# EAGLE design mr_radar_sandcastle (EAGLE 5.11)
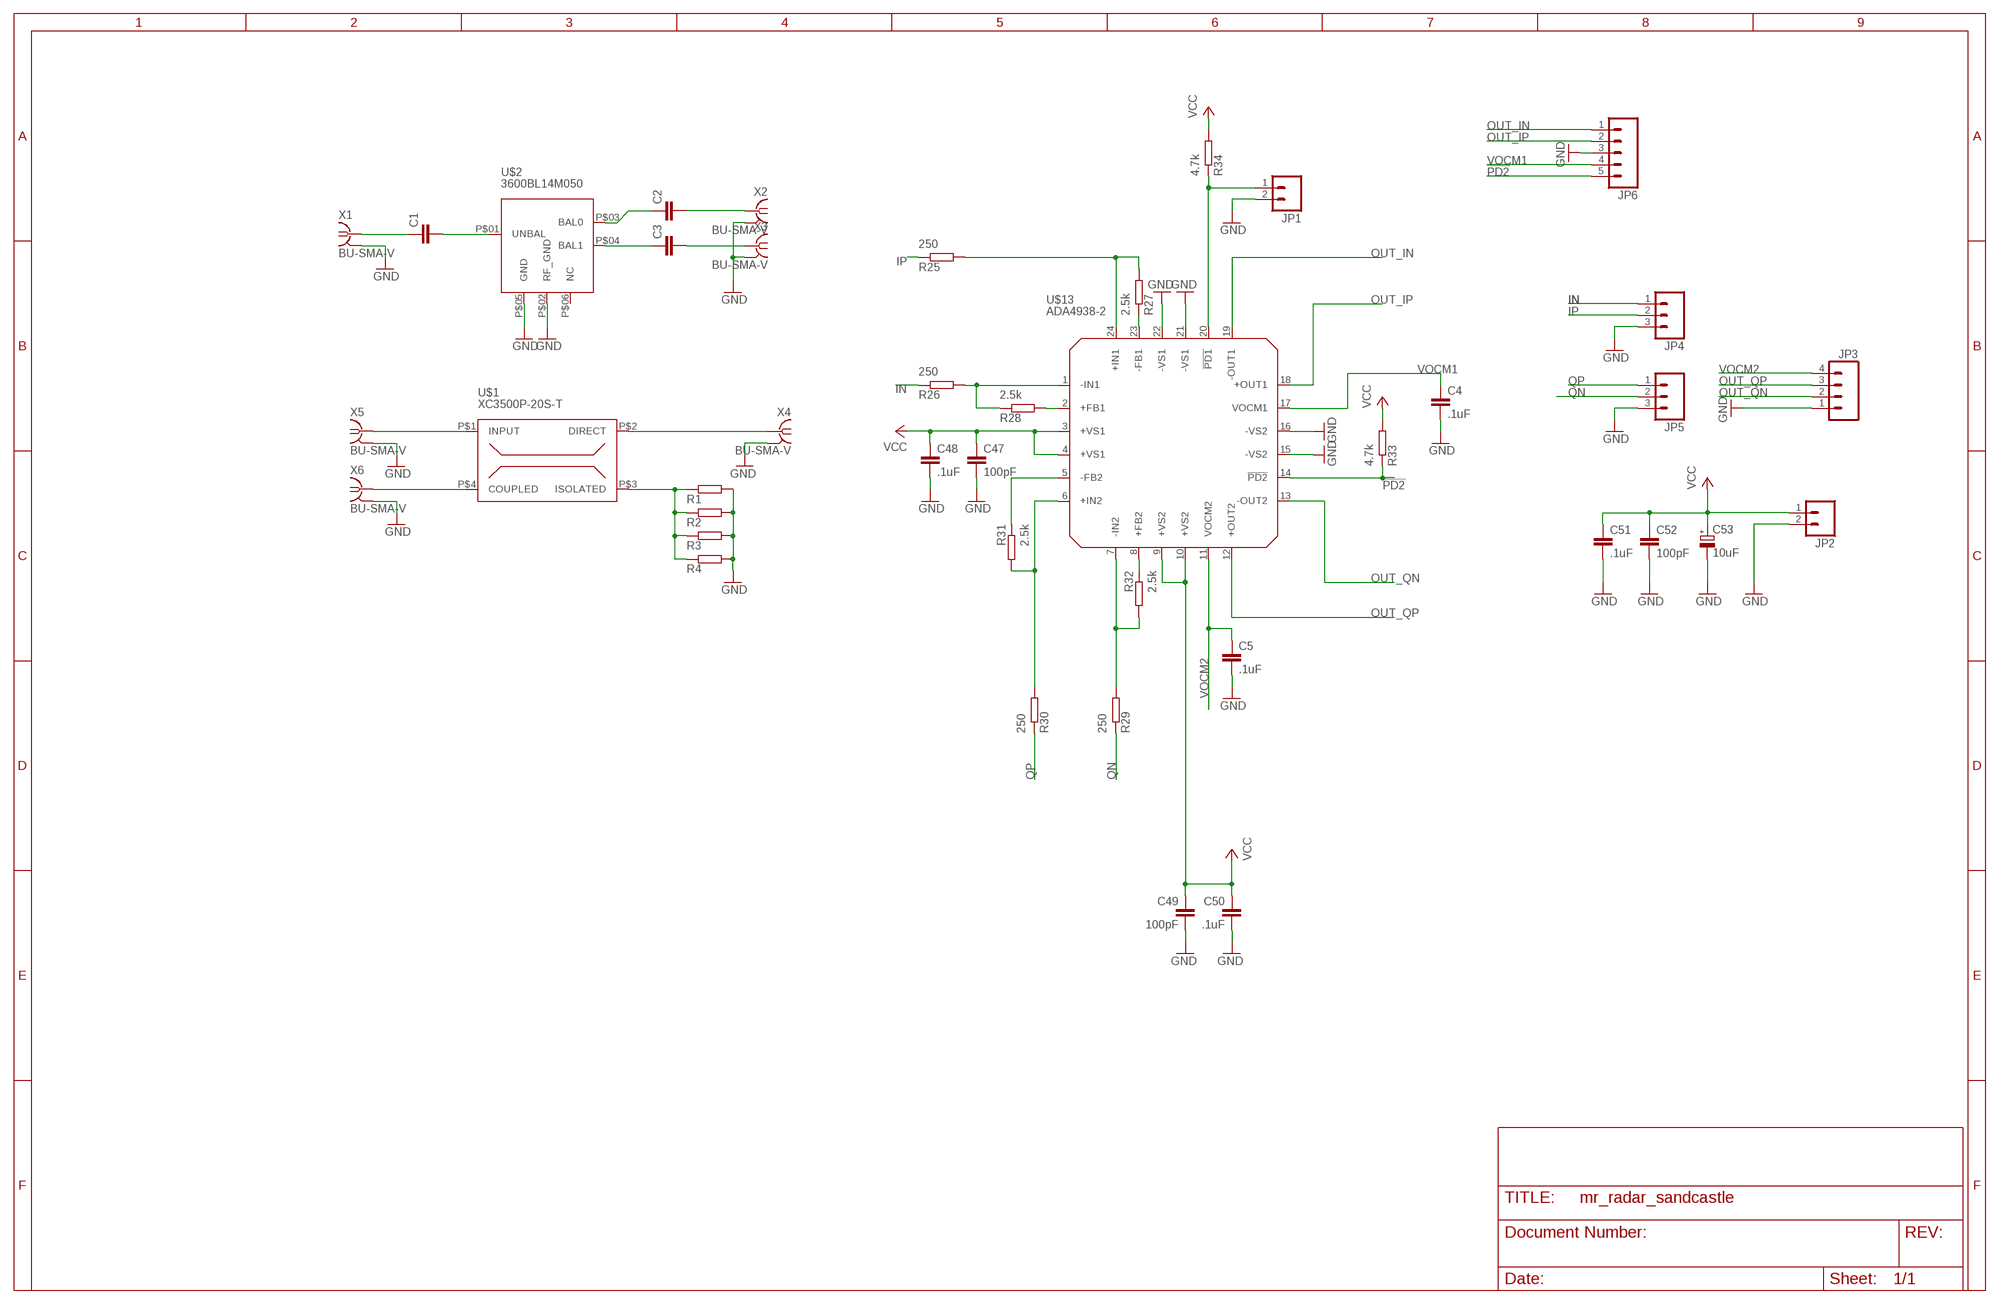
[diagram p0: schematic, sheet 1]

## Parts
C1  CAPACITOR-0603  [0603-CAP]
C2  CAPACITOR-0603  [0603-CAP]
C3  CAPACITOR-0603  [0603-CAP]
C4  .1uF  CAPACITOR-0603  [0603-CAP]
C5  .1uF  CAPACITOR-0603  [0603-CAP]
C47  100pF  CAPACITOR-0603  [0603-CAP]
C48  .1uF  CAPACITOR-0603  [0603-CAP]
C49  100pF  CAPACITOR-0603  [0603-CAP]
C50  .1uF  CAPACITOR-0603  [0603-CAP]
C51  .1uF  CAPACITOR-0603  [0603-CAP]
C52  100pF  CAPACITOR-0603  [0603-CAP]
C53  10uF  CAPACITOR-POL-0805  [0805-POL-CAP]
JP1  M02PTH  [1X02]
JP2  M02PTH  [1X02]
JP3  M04PTH  [1X04]
JP4  M03PTH  [1X03]
JP5  M03PTH  [1X03]
JP6  M05PTH  [1X05]
R1  RESISTOR-0402  [0402-RES]
R2  RESISTOR-0402  [0402-RES]
R3  RESISTOR-0402  [0402-RES]
R4  RESISTOR-0402  [0402-RES]
R25  250  RESISTOR-0603  [0603-RES]
R26  250  RESISTOR-0603  [0603-RES]
R27  2.5k  RESISTOR-0603  [0603-RES]
R28  2.5k  RESISTOR-0603  [0603-RES]
R29  250  RESISTOR-0603  [0603-RES]
R30  250  RESISTOR-0603  [0603-RES]
R31  2.5k  RESISTOR-0603  [0603-RES]
R32  2.5k  RESISTOR-0603  [0603-RES]
R33  4.7k  RESISTOR-0603  [0603-RES]
R34  4.7k  RESISTOR-0603  [0603-RES]
U$1  XC3500P-20S-T  [XC3500P-20S-T]
U$2  3600BL14M050  [3600BL14M050]
U$13  ADA4938-2  [LFCSP24]
X1  BU-SMA-V  [BU-SMA-V]
X2  BU-SMA-V  [BU-SMA-V]
X3  BU-SMA-V  [BU-SMA-V]
X4  BU-SMA-V  [BU-SMA-V]
X5  BU-SMA-V  [BU-SMA-V]
X6  BU-SMA-V  [BU-SMA-V]

## Nets
!PD2: JP6.5 R33.P$1 U$13.14(!PD2)
GND: C4.P$2 C5.P$2 C47.P$2 C48.P$2 C49.P$2 C50.P$2 C51.P$2 C52.P$2 C53.- JP1.2 JP2.2 JP3.1 JP4.3 JP5.3 JP6.3 R1.P$2 R2.P$2 R3.P$2 R4.P$2 U$2.P$02(RF_GND) U$2.P$05(GND) U$13.15(-VS2) U$13.16(-VS2) U$13.21(-VS1) U$13.22(-VS1) X1.2(GND) X2.2(GND) X3.2(GND) X4.2(GND) X5.2(GND) X6.2(GND)
IN: JP4.1 R26.P$1
IP: JP4.2 R25.P$1
N$1: C1.P$1 X1.1
N$2: C3.P$1 U$2.P$04(BAL1)
N$3: C2.P$1 U$2.P$03(BAL0)
N$4: C1.P$2 U$2.P$01(UNBAL)
N$5: C3.P$2 X3.1
N$6: C2.P$2 X2.1
N$7: R1.P$1 R2.P$1 R3.P$1 R4.P$1 U$1.P$3(ISOLATED)
N$12: U$1.P$1(INPUT) X5.1
N$13: U$1.P$4(COUPLED) X6.1
N$14: U$1.P$2(DIRECT) X4.1
N$59: R26.P$2 R28.P$1 U$13.1(-IN1)
N$60: R28.P$2 U$13.2(+FB1)
N$61: R30.P$2 R31.P$2 U$13.6(+IN2)
N$63: R29.P$2 R32.P$2 U$13.7(-IN2)
N$64: R27.P$1 U$13.23(-FB1)
N$65: R32.P$1 U$13.8(+FB2)
N$67: R25.P$2 R27.P$2 U$13.24(+IN1)
N$68: R31.P$1 U$13.5(-FB2)
N$70: JP1.1 R34.P$1 U$13.20(!PD1)
OUT_IN: JP6.1 U$13.19(-OUT1)
OUT_IP: JP6.2 U$13.18(+OUT1)
OUT_QN: JP3.2 U$13.13(-OUT2)
OUT_QP: JP3.3 U$13.12(+OUT2)
QN: JP5.2 R29.P$1
QP: JP5.1 R30.P$1
VCC: C47.P$1 C48.P$1 C49.P$1 C50.P$1 C51.P$1 C52.P$1 C53.+ JP2.1 R33.P$2 R34.P$2 U$13.3(+VS1) U$13.4(+VS1) U$13.9(+VS2) U$13.10(+VS2)
VOCM1: C4.P$1 JP6.4 U$13.17(VOCM1)
VOCM2: C5.P$1 JP3.4 U$13.11(VOCM2)
Unconnected: U$2.P$06(NC)

## Power pins joined to a net without a drawn wire
GND: U$13.EXP(GND) X1.3(GND) X1.4(GND) X1.5(GND) X2.3(GND) X2.4(GND) X2.5(GND) X3.3(GND) X3.4(GND) X3.5(GND) X4.3(GND) X4.4(GND) X4.5(GND) X5.3(GND) X5.4(GND) X5.5(GND) X6.3(GND) X6.4(GND) X6.5(GND)

## Library data of the parts
C1-C5 C47-C52 = pel_dipol_comp:CAPACITOR
C53 = pel_dipol_comp:CAPACITOR-POL
JP1 JP2 = SparkFun:M02: Header 2 Standard 2-pin 0.1" header. Use with straight break away headers (SKU : PRT-00116), right angle break away headers (PRT-00553), swiss pins (PRT-00743), machine pins (PRT-00117), and female headers (PRT-00115). Molex polarized connector foot print use with SKU : PRT-08233 with associated crimp pins and housings.
JP3 = SparkFun2:M04: Header 4 Standard 4-pin 0.1" header. Use with straight break away headers (SKU : PRT-00116), right angle break away headers (PRT-00553), swiss pins (PRT-00743), machine pins (PRT-00117), and female headers (PRT-00115). Molex polarized connector foot print use with SKU : PRT-08231 with associated crimp pins and housings.
JP4 JP5 = SparkFun:M03: Header 3 Standard 3-pin 0.1" header. Use with straight break away headers (SKU : PRT-00116), right angle break away headers (PRT-00553), swiss pins (PRT-00743), machine pins (PRT-00117), and female headers (PRT-00115). Molex polarized connector foot print use with SKU : PRT-08232 with associated crimp pins and housings.
JP6 = SparkFun2:M05: Header 5 Standard 5-pin 0.1" header. Use with straight break away headers (SKU : PRT-00116), right angle break away headers (PRT-00553), swiss pins (PRT-00743), machine pins (PRT-00117), and female headers (PRT-00115). Molex polarized connector foot print use with SKU : PRT-08230 with associated crimp pins and housings.
R1-R4 R25-R34 = pel_dipol_comp:RESISTOR
U$1 = mr_radar:XC3500P-20S-T
U$2 = mr_radar:3600BL14M050
U$13 = mr_radar:ADA4938-2
X1-X6 = con-coax:BU-SMA-V: FEMALE SMA CONNECTOR Radiall distributor RS 112-3794; OC_FARNELL: unknown; OC_NEWARK: unknown

## Board
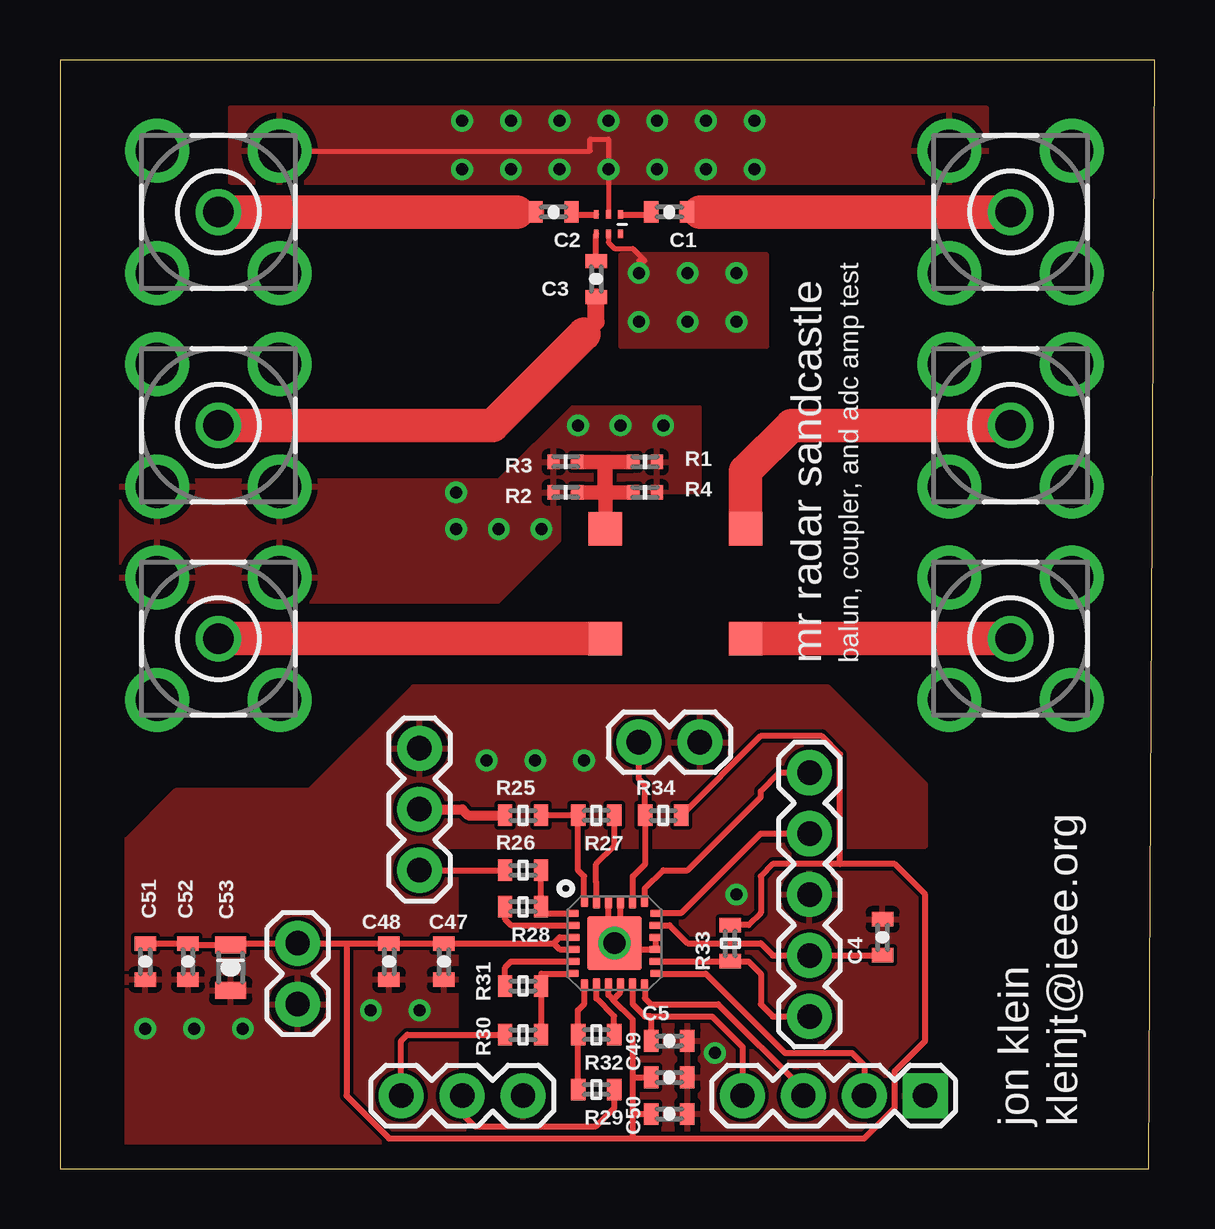
[diagram p1: board, top side]
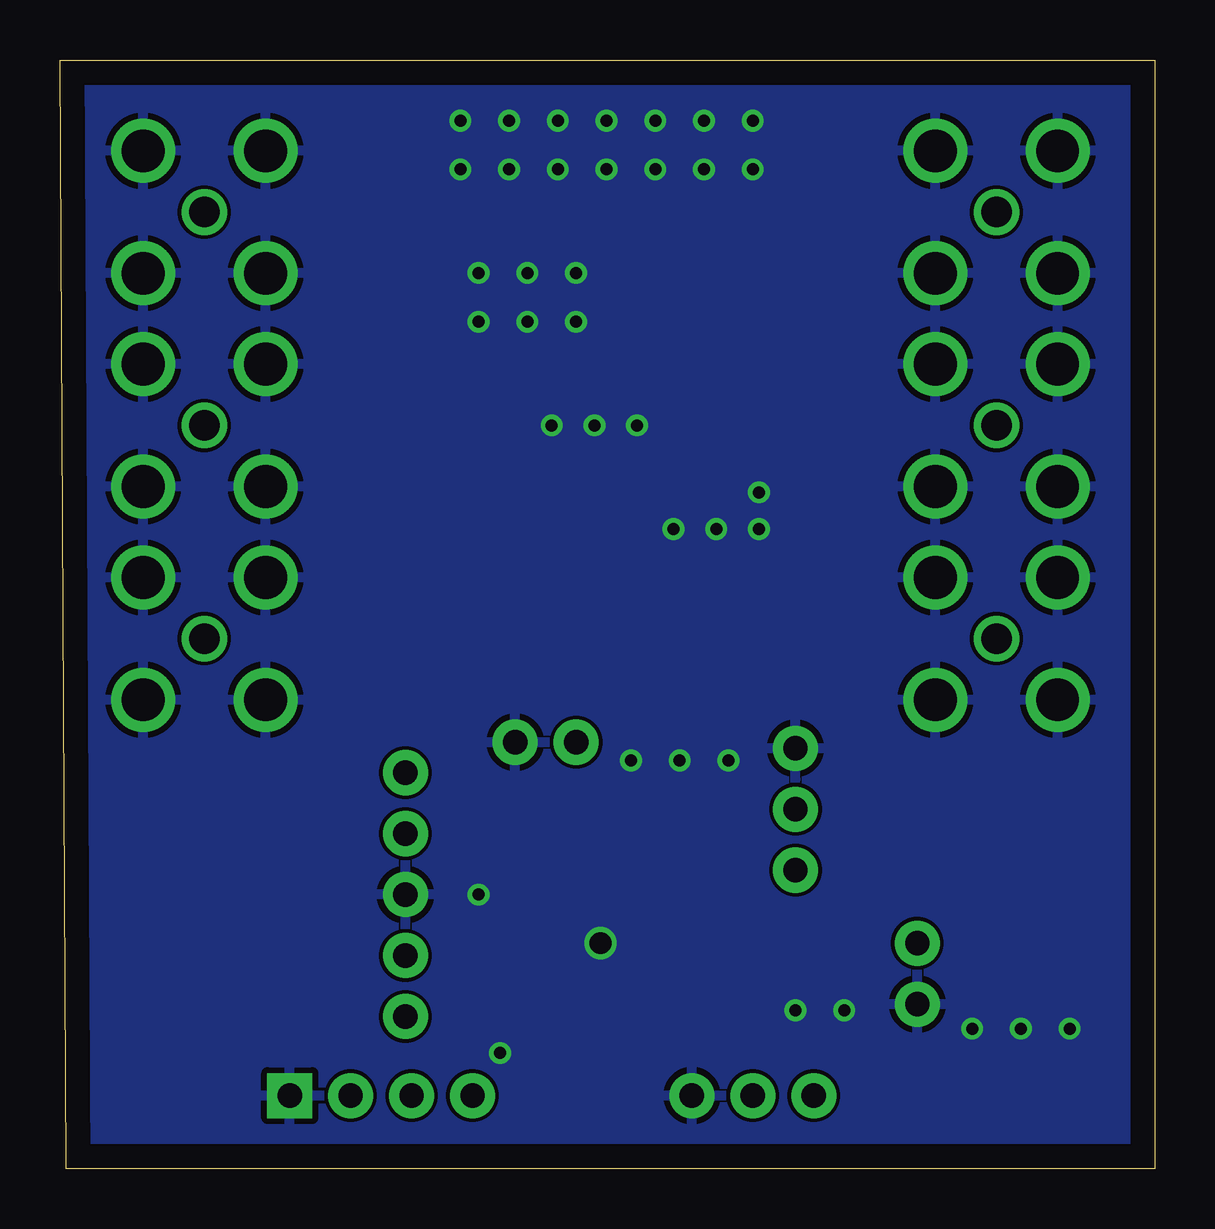
[diagram p2: board, bottom side, seen from below]

Size 45.64 x 46.22 mm. Coordinates in mm from the lower left corner, seen from the top.
Outline: 0,0 45.39,0 45.64,46.22 0,46.22 0,0
Copper layers (1*16): Top 0.035mm / dielectric 1.5mm / Bottom 0.035mm
Design rules "default *": minimum track width 6mil, minimum drill 24mil, track to track 6mil, track to pad 6mil, pad to pad 6mil, via to via 6mil, smd to smd 6mil, copper to edge 40mil, drill to drill 8mil, minimum pad ring 10mil, minimum via ring 8mil, stop-mask expansion 4mil, vias tented up to drill 0mil, thermal gap 10mil

### Footprints (pad centres in the part's own frame; a part is rotated, then mirrored left to right if it is on the bottom)
0603-CAP = smd 0.6 x 0.9: P$1 -0.75,0; P$2 0.75,0
0805-POL-CAP = smd 0.7 x 1.3: + -0.95,0; - 0.95,0
1X02 = drill 1.016 pad 1.88 round: 1 0,0; 2 2.54,0
1X04 = drill 1.016 pad 1.88 square: 1 0,0 | drill 1.016 pad 1.88 round: 2 2.54,0; 3 5.08,0; 4 7.62,0
1X03 = drill 1.016 pad 1.88 round: 1 0,0; 2 2.54,0; 3 5.08,0
1X05 = drill 1.016 pad 1.88 round: 1 0,0; 2 2.54,0; 3 5.08,0; 4 7.62,0; 5 10.16,0
0402-RES = smd 0.5 x 0.6: P$1 -0.5,0; P$2 0.5,0
0603-RES = smd 0.6 x 0.9: P$1 -0.75,0; P$2 0.75,0
XC3500P-20S-T = smd 1.397 x 1.397: P$1 -2.921,2.286; P$2 2.921,2.286; P$3 2.921,-2.286; P$4 -2.921,-2.286
3600BL14M050 = smd 0.203 x 0.356: P$01 0.508,0.406; P$02 0,0.406; P$03 -0.508,0.406; P$04 -0.508,-0.406; P$05 0,-0.406; P$06 0.508,-0.406
LFCSP24 = smd 0.5 x 0.3: 1 -1.75,1.25; 6 -1.75,-1.25; 13 1.75,-1.25; 18 1.75,1.25 | smd 0.55 x 0.3: 2 -1.725,0.75; 3 -1.725,0.25; 4 -1.725,-0.25; 5 -1.725,-0.75; 14 1.725,-0.75; 15 1.725,-0.25; 16 1.725,0.25; 17 1.725,0.75 | smd 0.3 x 0.5: 7 -1.25,-1.75; 12 1.25,-1.75; 19 1.25,1.75; 24 -1.25,1.75 | smd 0.3 x 0.55: 8 -0.75,-1.725; 9 -0.25,-1.725; 10 0.25,-1.725; 11 0.75,-1.725; 20 0.75,1.725; 21 0.25,1.725; 22 -0.25,1.725; 23 -0.75,1.725 | smd 2.25 x 2.25: EXP 0,0
BU-SMA-V = drill 1.27 round: 1 0,0 | drill 1.778 round: 2 -2.55,2.55; 3 2.55,2.55; 4 2.55,-2.55; 5 -2.55,-2.55

### Placement (x,y rotation side)
C1  25.4,39.88 180 top
C2  20.57,39.88 180 top
C3  22.35,37.08 270 top
C4  34.29,9.65 90 top
C5  25.4,5.33 0 top
C47  16,8.64 270 top
C48  13.72,8.64 270 top
C49  25.4,3.81 0 top
C50  25.4,2.29 0 top
C51  3.56,8.64 270 top
C52  5.33,8.64 270 top
C53  7.11,8.38 270 top
JP1  24.13,17.78 0 top
JP2  9.91,9.4 270 top
JP3  36.07,3.05 180 top
JP4  14.99,12.45 90 top
JP5  14.22,3.05 0 top
JP6  31.24,16.51 270 top
R1  24.38,29.46 0 top
R2  21.08,28.19 180 top
R3  21.08,29.46 180 top
R4  24.38,28.19 0 top
R25  19.3,14.73 0 top
R26  19.3,12.45 0 top
R27  22.35,14.73 180 top
R28  19.3,10.92 180 top
R29  22.35,3.3 180 top
R30  19.3,5.59 0 top
R31  19.3,7.62 0 top
R32  22.35,5.59 180 top
R33  27.94,9.4 90 top
R34  25.15,14.73 0 top
U$1  25.65,24.38 180 top
U$2  22.86,39.37 0 top
U$13  23.11,9.4 0 top
X1  39.62,39.88 180 top
X2  6.6,39.88 0 top
X3  6.6,30.99 270 top
X4  6.6,22.1 0 top
X5  39.62,22.1 0 top
X6  39.62,30.99 0 top

### Tracks (layer width: path | path; a pad name or v marks a point on that pad's centre or on a via)
!PD2
  Top 0.254: U$13.14 R33.P$1 27.95,8.64 28.7,8.64 29.21,8.13 29.21,6.86 29.72,6.35 JP6.5
GND  (via drill 0.5, 0.9)
  Top 0.203: U$2.P$02 22.86,42.93 22.1,42.93 22.1,42.42 8.38,42.42 8.38,42.43 X2.3 | U$2.P$05 22.86,38.61 23.11,38.35 23.88,38.35 24.38,37.85 24.13,37.85
  Top 0.254: U$13.22 22.86,10.16 23.11,9.91 | 23.11,9.91 U$13.EXP 23.62,9.4 23.88,9.14 23.88,9.15 U$13.15 | U$13.15 | U$13.15 U$13.16 | U$13.21 23.36,10.16 23.11,9.91
  other vias: 23.11,9.4 23.37,30.99 21.59,30.99 25.15,30.99 20.07,26.67 18.29,26.67 16.51,26.67 16.51,28.19 24.13,37.34 24.13,35.31 26.16,37.34 26.16,35.31 28.19,35.31 28.19,37.34 22.86,41.66 24.89,41.66 26.92,41.66 28.96,41.66 20.83,41.66 18.8,41.66 16.76,41.66 16.76,43.69 18.8,43.69 20.83,43.69 22.86,43.69 24.89,43.69 26.92,43.69 28.96,43.69 21.84,17.02 19.81,17.02 17.78,17.02 28.19,11.43 14.99,6.6 12.95,6.6 7.62,5.84 5.59,5.84 3.56,5.84 27.3,4.83
  pour Bottom: 0.25,46.23 0.25,0.51 45.97,0.51 45.97,46.23
  pour Top: 2.54,28.7 2.54,23.62 18.29,23.62 20.83,26.16 20.83,27.69 21.34,28.19 26.67,28.19 26.67,31.75 21.34,31.75 18.29,28.7
  pour Top: 2.79,13.72 2.79,13.46 36.07,13.46 36.07,16 32,20.07 14.73,20.07 10.41,15.75 4.83,15.75
  pour Top: 7.11,41.15 38.61,41.15 38.61,44.2 7.11,44.2
  pour Top: 23.37,38.1 23.37,34.29 29.46,34.29 29.46,38.1
  pour Top: 2.79,13.46 2.79,1.02 35.81,1.02 35.81,13.46 25.91,13.46 25.91,6.6 21.08,6.6 21.08,2.03 16.51,2.03 16.51,13.46
IN
  Top 0.254: JP4.1 R26.P$1
IP
  Top 0.406: JP4.2 16.76,14.99 17.02,14.73 R25.P$1
N$1
  Top 0.711: C1.P$1 26.67,39.88
  Top 1.397: 26.67,39.88 X1.1
N$2
  Top 0.254: C3.P$1 U$2.P$04
N$3
  Top 0.254: U$2.P$03 21.43,39.78 C2.P$1
N$4
  Top 0.254: U$2.P$01 24.55,39.78 C1.P$2
N$5
  Top 0.711: C3.P$2 22.35,35.31 21.84,34.8
  Top 1.397: X3.1 18.03,30.99 21.84,34.8
N$6
  Top 0.711: 19.05,39.88 C2.P$2
  Top 1.397: X2.1 19.05,39.88
N$7
  Top 0.406: 22.86,29.46 22.61,29.46 22.61,28.19
  Top 0.61: R2.P$1 22.61,28.19 R4.P$1 | 22.73,29.46 R3.P$1 | R1.P$1 22.86,29.46 22.73,29.46 | 22.73,29.46 U$1.P$3
N$12
  Top 1.397: U$1.P$1 X5.1
N$13
  Top 1.397: U$1.P$4 28.58,29.08 30.48,30.99 X6.1
N$14
  Top 1.397: X4.1 U$1.P$2
N$59
  Top 0.254: U$13.1 20.05,10.65 R28.P$1 R26.P$2
N$60
  Top 0.254: U$13.2 18.81,10.15 18.55,10.4 R28.P$2
N$61
  Top 0.254: R30.P$2 R31.P$2 20.07,7.62 20.07,8.13 21.36,8.13 U$13.6
N$63
  Top 0.254: U$13.7 21.86,6.88 21.59,6.6 21.59,5.6 R32.P$2 R29.P$2
N$64
  Top 0.254: R27.P$1 23.11,13.46 22.35,12.7 22.35,11.94 22.36,11.93 U$13.23
N$65
  Top 0.254: R32.P$1 23.1,6.36 22.36,7.1 U$13.8
N$67
  Top 0.254: U$13.24 21.84,11.15 21.84,12.19 21.6,12.43 R27.P$2 R25.P$2
N$68
  Top 0.254: R31.P$1 18.55,8.39 18.8,8.64 21.38,8.64 U$13.5
N$70
  Top 0.254: U$13.20 23.88,11.14 23.88,12.19 24.4,12.71 R34.P$1 24.38,14.74 24.38,16 24.13,16.26 JP1.1
OUT_IN
  Top 0.254: U$13.19 24.38,11.17 24.38,11.68 25.15,12.45 26.16,12.45 29.21,15.49 29.21,15.75 29.97,16.51 JP6.1
OUT_IP
  Top 0.254: U$13.18 24.88,10.67 25.91,10.67 29.21,13.97 JP6.2
OUT_QN
  Top 0.254: U$13.13 24.88,8.13 26.92,8.13 30.23,4.83 33.02,4.83 33.53,4.32 JP3.2
OUT_QP
  Top 0.254: U$13.12 24.38,7.63 24.38,7.11 24.64,6.86 27.43,6.86 30.99,3.3 JP3.3
QN
  Top 0.254: R29.P$1 23.11,2.54 22.35,1.78 17.27,1.78 16.76,2.29 JP5.2
QP
  Top 0.254: R30.P$1 14.48,5.59 14.22,5.33 JP5.1
VCC
  Top 0.254: U$13.3 20.83,9.65 20.57,9.4 | U$13.4 20.82,9.15 20.57,9.4 | 20.57,9.4 C47.P$1 C48.P$1 11.94,9.39 | U$13.9 22.86,7.24 23.05,7.05 | C51.P$1 C52.P$1 5.39,9.33 C53.+ 7.18,9.4 JP2.1 9.91,9.39 11.94,9.39 | R33.P$2 27.95,10.16 28.7,10.16 29.21,10.67 29.21,12.19 29.72,12.7 32.51,12.7 | R34.P$2 29.2,18.03 31.75,18.03 32.51,17.27 32.51,12.7 | 11.94,9.39 11.94,3.05 13.72,1.27 23.88,1.27 | 32.51,12.7 34.8,12.7 36.07,11.43 36.07,5.33 34.8,4.06 34.8,2.54 33.53,1.27 23.88,1.27 | 23.88,1.27 23.88,2.29 | 23.88,2.29 23.88,3.81 | 23.88,2.29 C50.P$1 | 23.88,3.81 C49.P$1 | 23.05,7.05 23.88,6.22 23.88,3.81 | U$13.10 23.36,7.36 23.05,7.05
VOCM1
  Top 0.254: U$13.17 25.41,10.15 26.16,9.4 29.21,9.4 29.72,8.89 JP6.4 31.25,8.9 C4.P$1
VOCM2
  Top 0.254: U$13.11 23.88,7.66 23.88,6.86 24.38,6.35 24.64,6.35 | 24.64,6.35 24.65,6.34 C5.P$1 | JP3.4 28.45,5.08 27.18,6.35 24.64,6.35

### Text on the board
_tsilk: mr radar sandcastle | balun, coupler, and adc amp test | jon klein | kleinjt@ieee.org